# EAGLE schematic Rover BeagleBone Cape (EAGLE 7.1.0)
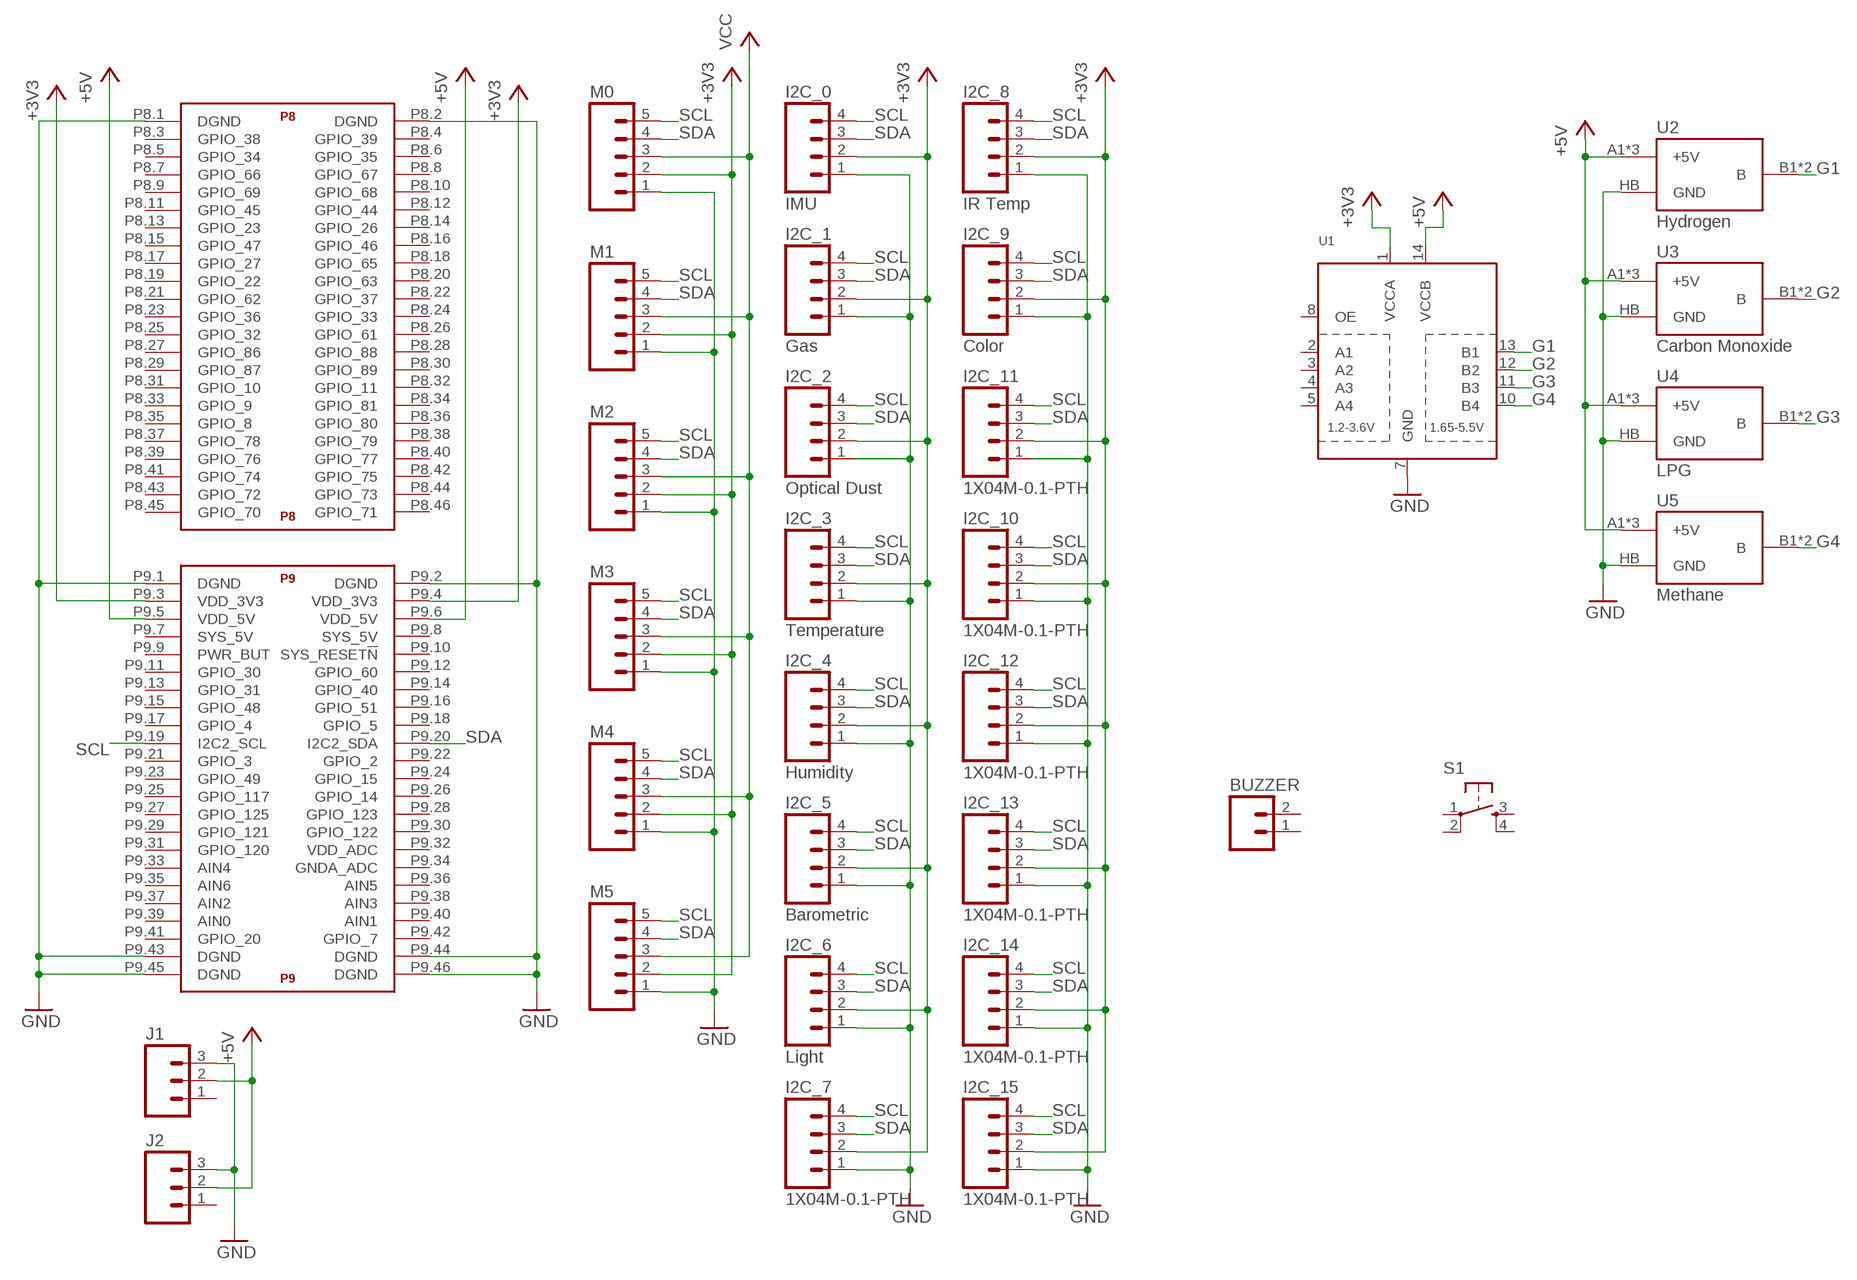
[diagram p0: schematic, sheet 1]

## Parts
BUZZER  1X02M-0.1-PTH  [M-1X02-0.1-PTH]
I2C_0  IMU  1X04M-0.1-PTH  [M-1X04-0.1-PTH]
I2C_1  Gas  1X04M-0.1-PTH  [M-1X04-0.1-PTH]
I2C_2  Optical Dust  1X04M-0.1-PTH  [M-1X04-0.1-PTH]
I2C_3  Temperature  1X04M-0.1-PTH  [M-1X04-0.1-PTH]
I2C_4  Humidity  1X04M-0.1-PTH  [M-1X04-0.1-PTH]
I2C_5  Barometric  1X04M-0.1-PTH  [M-1X04-0.1-PTH]
I2C_6  Light  1X04M-0.1-PTH  [M-1X04-0.1-PTH]
I2C_7  1X04M-0.1-PTH  [M-1X04-0.1-PTH]
I2C_8  IR Temp  1X04M-0.1-PTH  [M-1X04-0.1-PTH]
I2C_9  Color  1X04M-0.1-PTH  [M-1X04-0.1-PTH]
I2C_10  1X04M-0.1-PTH  [M-1X04-0.1-PTH]
I2C_11  1X04M-0.1-PTH  [M-1X04-0.1-PTH]
I2C_12  1X04M-0.1-PTH  [M-1X04-0.1-PTH]
I2C_13  1X04M-0.1-PTH  [M-1X04-0.1-PTH]
I2C_14  1X04M-0.1-PTH  [M-1X04-0.1-PTH]
I2C_15  1X04M-0.1-PTH  [M-1X04-0.1-PTH]
J1  1X03M-0.1-PTH  [M-1X03-0.1-PTH]
J2  1X03M-0.1-PTH  [M-1X03-0.1-PTH]
M0  1X05M-0.1-PTH  [M-1X05-0.1-PTH]
M1  1X05M-0.1-PTH  [M-1X05-0.1-PTH]
M2  1X05M-0.1-PTH  [M-1X05-0.1-PTH]
M3  1X05M-0.1-PTH  [M-1X05-0.1-PTH]
M4  1X05M-0.1-PTH  [M-1X05-0.1-PTH]
M5  1X05M-0.1-PTH  [M-1X05-0.1-PTH]
S1  SWITCH-TACTILESMD  [SWITCH-TACTILE-SMD]
U1  TXB0104PWR  [TSSOP14]
U2  Hydrogen  GAS-SENSORMQ  [MQ-X]
U3  Carbon Monoxide  GAS-SENSORMQ  [MQ-X]
U4  LPG  GAS-SENSORMQ  [MQ-X]
U5  Methane  GAS-SENSORMQ  [MQ-X]
U$1  BEAGLE_BONE_BLACK_CAPE  [BEAGLE_BONE_BLACK_CAPE]

## Nets
+3V3: I2C_0.2 I2C_1.2 I2C_2.2 I2C_3.2 I2C_4.2 I2C_5.2 I2C_6.2 I2C_7.2 I2C_8.2 I2C_9.2 I2C_10.2 I2C_11.2 I2C_12.2 I2C_13.2 I2C_14.2 I2C_15.2 M0.2 M1.2 M2.2 M3.2 M4.2 M5.2 U1.1(VCCA) U$1.P9.3(P9:VDD_3V3) U$1.P9.4(P9:VDD_3V3)
+5V: J1.2 J2.2 U1.14(VCCB) U2.A1(+5V) U2.A2(+5V) U2.HA(+5V) U3.A1(+5V) U3.A2(+5V) U3.HA(+5V) U4.A1(+5V) U4.A2(+5V) U4.HA(+5V) U5.A1(+5V) U5.A2(+5V) U5.HA(+5V) U$1.P9.5(P9:VDD_5V) U$1.P9.6(P9:VDD_5V)
G1: U1.13(B1) U2.B1(B) U2.B2(B)
G2: U1.12(B2) U3.B1(B) U3.B2(B)
G3: U1.11(B3) U4.B1(B) U4.B2(B)
G4: U1.10(B4) U5.B1(B) U5.B2(B)
GND: I2C_0.1 I2C_1.1 I2C_2.1 I2C_3.1 I2C_4.1 I2C_5.1 I2C_6.1 I2C_7.1 I2C_8.1 I2C_9.1 I2C_10.1 I2C_11.1 I2C_12.1 I2C_13.1 I2C_14.1 I2C_15.1 J1.3 J2.3 M0.1 M1.1 M2.1 M3.1 M4.1 M5.1 U1.7(GND) U2.HB(GND) U3.HB(GND) U4.HB(GND) U5.HB(GND) U$1.P8.1(P8:DGND) U$1.P8.2(P8:DGND) U$1.P9.1(P9:DGND) U$1.P9.2(P9:DGND) U$1.P9.43(P9:DGND) U$1.P9.44(P9:DGND) U$1.P9.45(P9:DGND) U$1.P9.46(P9:DGND)
SCL: I2C_0.4 I2C_1.4 I2C_2.4 I2C_3.4 I2C_4.4 I2C_5.4 I2C_6.4 I2C_7.4 I2C_8.4 I2C_9.4 I2C_10.4 I2C_11.4 I2C_12.4 I2C_13.4 I2C_14.4 I2C_15.4 M0.5 M1.5 M2.5 M3.5 M4.5 M5.5 U$1.P9.19(P9:I2C2_SCL)
SDA: I2C_0.3 I2C_1.3 I2C_2.3 I2C_3.3 I2C_4.3 I2C_5.3 I2C_6.3 I2C_7.3 I2C_8.3 I2C_9.3 I2C_10.3 I2C_11.3 I2C_12.3 I2C_13.3 I2C_14.3 I2C_15.3 M0.4 M1.4 M2.4 M3.4 M4.4 M5.4 U$1.P9.20(P9:I2C2_SDA)
VCC: M0.3 M1.3 M2.3 M3.3 M4.3 M5.3
Unconnected: BUZZER.1 BUZZER.2 J1.1 J2.1 S1.1 S1.2 S1.3 S1.4 U1.2(A1) U1.3(A2) U1.4(A3) U1.5(A4) U1.8(OE) U$1.P8.3(P8:GPIO_38) U$1.P8.4(P8:GPIO_39) U$1.P8.5(P8:GPIO_34) U$1.P8.6(P8:GPIO_35) U$1.P8.7(P8:GPIO_66) U$1.P8.8(P8:GPIO_67) U$1.P8.9(P8:GPIO_69) U$1.P8.10(P8:GPIO_68) U$1.P8.11(P8:GPIO_45) U$1.P8.12(P8:GPIO_44) U$1.P8.13(P8:GPIO_23) U$1.P8.14(P8:GPIO_26) U$1.P8.15(P8:GPIO_47) U$1.P8.16(P8:GPIO_46) U$1.P8.17(P8:GPIO_27) U$1.P8.18(P8:GPIO_65) U$1.P8.19(P8:GPIO_22) U$1.P8.20(P8:GPIO_63) U$1.P8.21(P8:GPIO_62) U$1.P8.22(P8:GPIO_37) U$1.P8.23(P8:GPIO_36) U$1.P8.24(P8:GPIO_33) U$1.P8.25(P8:GPIO_32) U$1.P8.26(P8:GPIO_61) U$1.P8.27(P8:GPIO_86) U$1.P8.28(P8:GPIO_88) U$1.P8.29(P8:GPIO_87) U$1.P8.30(P8:GPIO_89) U$1.P8.31(P8:GPIO_10) U$1.P8.32(P8:GPIO_11) U$1.P8.33(P8:GPIO_9) U$1.P8.34(P8:GPIO_81) U$1.P8.35(P8:GPIO_8) U$1.P8.36(P8:GPIO_80) U$1.P8.37(P8:GPIO_78) U$1.P8.38(P8:GPIO_79) U$1.P8.39(P8:GPIO_76) U$1.P8.40(P8:GPIO_77) U$1.P8.41(P8:GPIO_74) U$1.P8.42(P8:GPIO_75) U$1.P8.43(P8:GPIO_72) U$1.P8.44(P8:GPIO_73) U$1.P8.45(P8:GPIO_70) U$1.P8.46(P8:GPIO_71) U$1.P9.7(P9:SYS_5V) U$1.P9.8(P9:SYS_5V) U$1.P9.9(P9:PWR_BUT) U$1.P9.10(P9:SYS_RESET!N) U$1.P9.11(P9:GPIO_30) U$1.P9.12(P9:GPIO_60) U$1.P9.13(P9:GPIO_31) U$1.P9.14(P9:GPIO_40) U$1.P9.15(P9:GPIO_48) U$1.P9.16(P9:GPIO_51) U$1.P9.17(P9:GPIO_4) U$1.P9.18(P9:GPIO_5) U$1.P9.21(P9:GPIO_3) U$1.P9.22(P9:GPIO_2) U$1.P9.23(P9:GPIO_49) U$1.P9.24(P9:GPIO_15) U$1.P9.25(P9:GPIO_117) U$1.P9.26(P9:GPIO_14) U$1.P9.27(P9:GPIO_125) U$1.P9.28(P9:GPIO_123) U$1.P9.29(P9:GPIO_121) U$1.P9.30(P9:GPIO_122) U$1.P9.31(P9:GPIO_120) U$1.P9.32(P9:VDD_ADC) U$1.P9.33(P9:AIN4) U$1.P9.34(P9:GNDA_ADC) U$1.P9.35(P9:AIN6) U$1.P9.36(P9:AIN5) U$1.P9.37(P9:AIN2) U$1.P9.38(P9:AIN3) U$1.P9.39(P9:AIN0) U$1.P9.40(P9:AIN1) U$1.P9.41(P9:GPIO_20) U$1.P9.42(P9:GPIO_7)

## Library data of the parts
BUZZER = Jordi:1X02
I2C_0 I2C_1-I2C_15 = Jordi:1X04
J1 J2 = Jordi:1X03
M0 M1-M5 = Jordi:1X05
S1 = Jordi:SWITCH-TACTILE
U1 = SparkFun-DigitalIC:TXB0104PWR: 4-Bit Bi-Directional Level Shifter 1.2V-3.6V (VCCA) to 1.65V-5.5V (VCCB) bi-directional level shifter with auto direction sensing. Max data rate - VCCA 1.8V: 20Mbps (50ns), VCCA 3.3V: 100Mbps (10ns) Digikey: 296-21929-1-ND (TSSOP) IC-11329
U2-U5 = Jordi:GAS-SENSOR
U$1 = SparkFun-Boards:BEAGLE_BONE_BLACK_CAPE